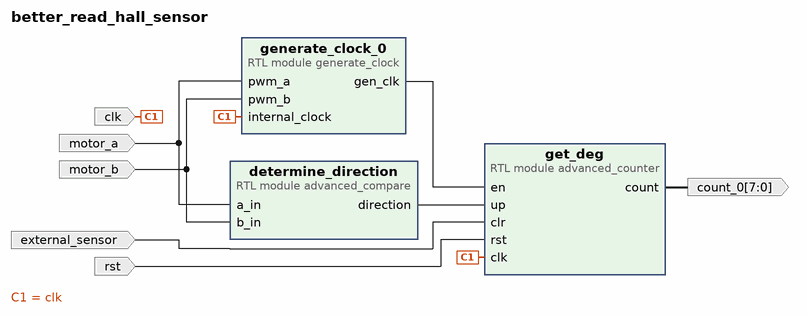
[diagram p0: block diagram of the top level]
# Vivado block design better_read_hall_sensor, xc7z020clg400-1, Vivado 2024.2
create_bd_design better_read_hall_sensor

create_bd_port -dir I motor_a
create_bd_port -dir I motor_b
create_bd_port -dir I -type clk clk
create_bd_port -dir I -type rst rst
create_bd_port -dir I external_sensor
create_bd_port -dir O -from 7 -to 0 count_0

create_bd_cell -type module -reference advanced_compare determine_direction
create_bd_cell -type module -reference advanced_counter get_deg
set_property -dict {CONFIG.n_bits 8} [get_bd_cells get_deg]
create_bd_cell -type module -reference generate_clock generate_clock_0

# ---- connections ----

connect_bd_net -net a_in_0_1 [get_bd_ports motor_a] [get_bd_pins determine_direction/a_in] [get_bd_pins generate_clock_0/pwm_a]
connect_bd_net -net advanced_compare_0_direction [get_bd_pins determine_direction/direction] [get_bd_pins get_deg/up]
connect_bd_net -net b_in_0_1 [get_bd_ports motor_b] [get_bd_pins determine_direction/b_in] [get_bd_pins generate_clock_0/pwm_b]
connect_bd_net -net clk_0_1 [get_bd_ports clk] [get_bd_pins get_deg/clk] [get_bd_pins generate_clock_0/internal_clock]
connect_bd_net -net clr_0_1 [get_bd_ports external_sensor] [get_bd_pins get_deg/clr]
connect_bd_net [get_bd_pins generate_clock_0/gen_clk] [get_bd_pins get_deg/en]
connect_bd_net [get_bd_pins get_deg/count] [get_bd_ports count_0]
connect_bd_net -net rst_0_1 [get_bd_ports rst] [get_bd_pins get_deg/rst]

validate_bd_design
save_bd_design
